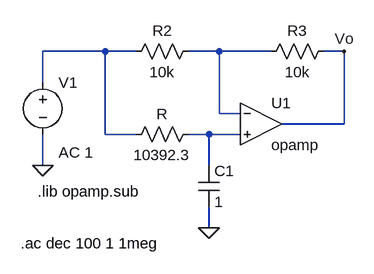
[diagram p0: schematic ej7_prueba1orden.asc]
ej7_prueba1orden.asc, the LTspice schematic file:
Version 4
SHEET 1 880 680
WIRE -32 48 -128 48
WIRE 16 48 -32 48
WIRE 144 48 96 48
WIRE 224 48 144 48
WIRE 336 48 304 48
WIRE -128 96 -128 48
WIRE 144 144 144 48
WIRE 176 144 144 144
WIRE 336 160 336 48
WIRE 336 160 240 160
WIRE -32 176 -32 48
WIRE 16 176 -32 176
WIRE 128 176 96 176
WIRE 176 176 128 176
WIRE -128 224 -128 176
WIRE 128 224 128 176
WIRE 128 320 128 288
FLAG 128 320 0
FLAG -128 224 0
FLAG 336 48 Vo
SYMBOL OpAmps\\opamp 208 96 R0
SYMATTR InstName U1
SYMBOL res 112 160 R90
WINDOW 0 0 56 VBottom 2
WINDOW 3 32 56 VTop 2
SYMATTR InstName R
SYMATTR Value 10392.3
SYMBOL res 112 32 R90
WINDOW 0 0 56 VBottom 2
WINDOW 3 32 56 VTop 2
SYMATTR InstName R2
SYMATTR Value 10k
SYMBOL res 320 32 R90
WINDOW 0 0 56 VBottom 2
WINDOW 3 32 56 VTop 2
SYMATTR InstName R3
SYMATTR Value 10k
SYMBOL cap 112 224 R0
SYMATTR InstName C1
SYMATTR Value 1
SYMBOL voltage -128 80 R0
WINDOW 123 24 124 Left 2
WINDOW 39 0 0 Left 0
SYMATTR InstName V1
SYMATTR Value ""
SYMATTR Value2 AC 1
TEXT -136 264 Left 2 !.lib opamp.sub
TEXT -162 344 Left 2 !.ac dec 100 1 1meg

The netlist it stands for:
* ej7_prueba1orden.asc
XU1 N002 N003 Vo opamp Aol=100K GBW=10Meg  ; pins invin noninvin out
R N003 N001 10392.3
R2 N002 N001 10k
R3 Vo N002 10k
C1 N003 0 1
V1 N001 0 AC 1
.lib opamp.sub
.ac dec 100 1 1meg
.backanno
.end